# EasyEDA Pro project ProDoc_Board1_2026-04-23.epro

# Schematic Schematic1
Board Name: Board1; Create Date: 2026-03-14; Page Name: P1; Project Name: ButtonMatrix; Schematic Name: Schematic1; Update Date: 2026-03-27; Company: EasyEDA.com; Page Size: A4; Version: V1.0
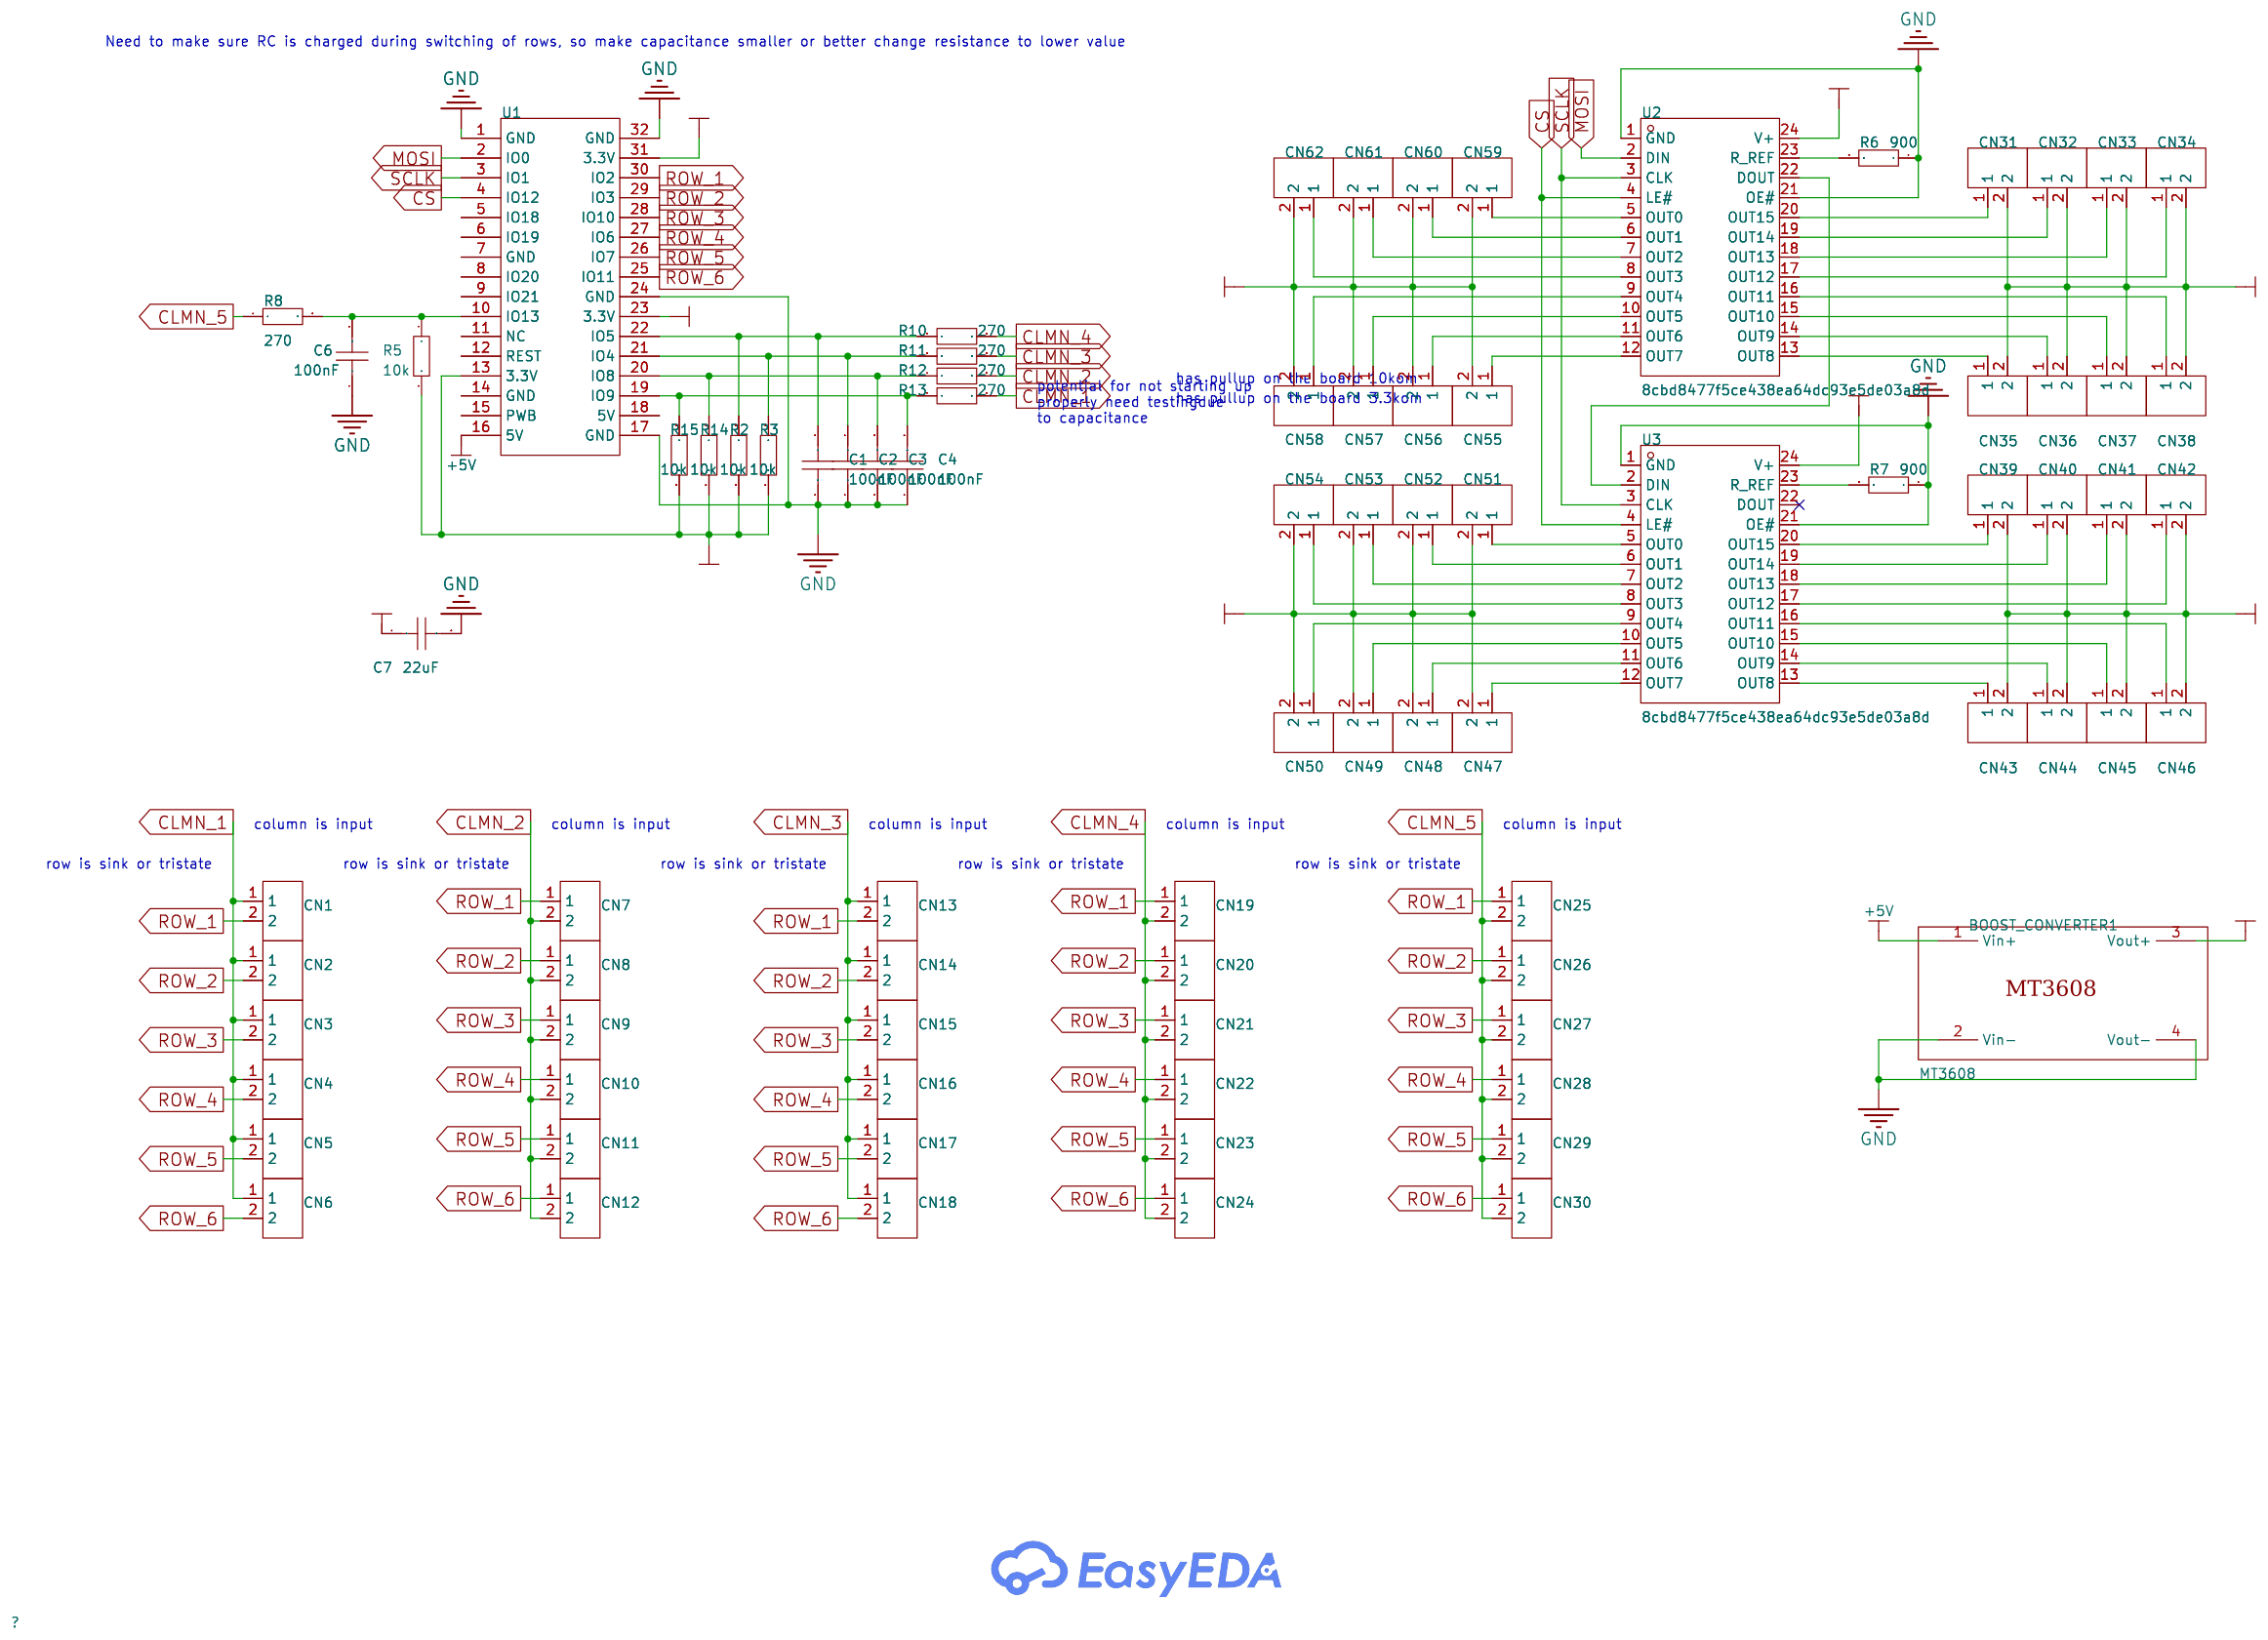
[diagram p0: schematic sheet]

## Parts
BOOST_CONVERTER1  MT3608  [MT3608 BOOST]
C1  100nF  [CAP-TH_L5.5-W2.4-P5.08-D0.6]
C2  100nF  [CAP-TH_L5.5-W2.4-P5.08-D0.6]
C3  100nF  [CAP-TH_L5.5-W2.4-P5.08-D0.6]
C4  100nF  [CAP-TH_L5.5-W2.4-P5.08-D0.6]
C6  100nF  [CAP-TH_L5.5-W2.4-P5.08-D0.6]
C7  22uF  [C1206]
CN1  HX-XH2.54-2PZZ  [CONN-TH_2P-P2.50_HX-2.54MM-2P-ZZ-MS]
CN2  HX-XH2.54-2PZZ  [CONN-TH_2P-P2.50_HX-2.54MM-2P-ZZ-MS]
CN3  HX-XH2.54-2PZZ  [CONN-TH_2P-P2.50_HX-2.54MM-2P-ZZ-MS]
CN4  HX-XH2.54-2PZZ  [CONN-TH_2P-P2.50_HX-2.54MM-2P-ZZ-MS]
CN5  HX-XH2.54-2PZZ  [CONN-TH_2P-P2.50_HX-2.54MM-2P-ZZ-MS]
CN6  HX-XH2.54-2PZZ  [CONN-TH_2P-P2.50_HX-2.54MM-2P-ZZ-MS]
CN7  HX-XH2.54-2PZZ  [CONN-TH_2P-P2.50_HX-2.54MM-2P-ZZ-MS]
CN8  HX-XH2.54-2PZZ  [CONN-TH_2P-P2.50_HX-2.54MM-2P-ZZ-MS]
CN9  HX-XH2.54-2PZZ  [CONN-TH_2P-P2.50_HX-2.54MM-2P-ZZ-MS]
CN10  HX-XH2.54-2PZZ  [CONN-TH_2P-P2.50_HX-2.54MM-2P-ZZ-MS]
CN11  HX-XH2.54-2PZZ  [CONN-TH_2P-P2.50_HX-2.54MM-2P-ZZ-MS]
CN12  HX-XH2.54-2PZZ  [CONN-TH_2P-P2.50_HX-2.54MM-2P-ZZ-MS]
CN13  HX-XH2.54-2PZZ  [CONN-TH_2P-P2.50_HX-2.54MM-2P-ZZ-MS]
CN14  HX-XH2.54-2PZZ  [CONN-TH_2P-P2.50_HX-2.54MM-2P-ZZ-MS]
CN15  HX-XH2.54-2PZZ  [CONN-TH_2P-P2.50_HX-2.54MM-2P-ZZ-MS]
CN16  HX-XH2.54-2PZZ  [CONN-TH_2P-P2.50_HX-2.54MM-2P-ZZ-MS]
CN17  HX-XH2.54-2PZZ  [CONN-TH_2P-P2.50_HX-2.54MM-2P-ZZ-MS]
CN18  HX-XH2.54-2PZZ  [CONN-TH_2P-P2.50_HX-2.54MM-2P-ZZ-MS]
CN19  HX-XH2.54-2PZZ  [CONN-TH_2P-P2.50_HX-2.54MM-2P-ZZ-MS]
CN20  HX-XH2.54-2PZZ  [CONN-TH_2P-P2.50_HX-2.54MM-2P-ZZ-MS]
CN21  HX-XH2.54-2PZZ  [CONN-TH_2P-P2.50_HX-2.54MM-2P-ZZ-MS]
CN22  HX-XH2.54-2PZZ  [CONN-TH_2P-P2.50_HX-2.54MM-2P-ZZ-MS]
CN23  HX-XH2.54-2PZZ  [CONN-TH_2P-P2.50_HX-2.54MM-2P-ZZ-MS]
CN24  HX-XH2.54-2PZZ  [CONN-TH_2P-P2.50_HX-2.54MM-2P-ZZ-MS]
CN25  HX-XH2.54-2PZZ  [CONN-TH_2P-P2.50_HX-2.54MM-2P-ZZ-MS]
CN26  HX-XH2.54-2PZZ  [CONN-TH_2P-P2.50_HX-2.54MM-2P-ZZ-MS]
CN27  HX-XH2.54-2PZZ  [CONN-TH_2P-P2.50_HX-2.54MM-2P-ZZ-MS]
CN28  HX-XH2.54-2PZZ  [CONN-TH_2P-P2.50_HX-2.54MM-2P-ZZ-MS]
CN29  HX-XH2.54-2PZZ  [CONN-TH_2P-P2.50_HX-2.54MM-2P-ZZ-MS]
CN30  HX-XH2.54-2PZZ  [CONN-TH_2P-P2.50_HX-2.54MM-2P-ZZ-MS]
CN31  HX-XH2.54-2PZZ  [CONN-TH_2P-P2.50_HX-2.54MM-2P-ZZ-MS]
CN32  HX-XH2.54-2PZZ  [CONN-TH_2P-P2.50_HX-2.54MM-2P-ZZ-MS]
CN33  HX-XH2.54-2PZZ  [CONN-TH_2P-P2.50_HX-2.54MM-2P-ZZ-MS]
CN34  HX-XH2.54-2PZZ  [CONN-TH_2P-P2.50_HX-2.54MM-2P-ZZ-MS]
CN35  HX-XH2.54-2PZZ  [CONN-TH_2P-P2.50_HX-2.54MM-2P-ZZ-MS]
CN36  HX-XH2.54-2PZZ  [CONN-TH_2P-P2.50_HX-2.54MM-2P-ZZ-MS]
CN37  HX-XH2.54-2PZZ  [CONN-TH_2P-P2.50_HX-2.54MM-2P-ZZ-MS]
CN38  HX-XH2.54-2PZZ  [CONN-TH_2P-P2.50_HX-2.54MM-2P-ZZ-MS]
CN39  HX-XH2.54-2PZZ  [CONN-TH_2P-P2.50_HX-2.54MM-2P-ZZ-MS]
CN40  HX-XH2.54-2PZZ  [CONN-TH_2P-P2.50_HX-2.54MM-2P-ZZ-MS]
CN41  HX-XH2.54-2PZZ  [CONN-TH_2P-P2.50_HX-2.54MM-2P-ZZ-MS]
CN42  HX-XH2.54-2PZZ  [CONN-TH_2P-P2.50_HX-2.54MM-2P-ZZ-MS]
CN43  HX-XH2.54-2PZZ  [CONN-TH_2P-P2.50_HX-2.54MM-2P-ZZ-MS]
CN44  HX-XH2.54-2PZZ  [CONN-TH_2P-P2.50_HX-2.54MM-2P-ZZ-MS]
CN45  HX-XH2.54-2PZZ  [CONN-TH_2P-P2.50_HX-2.54MM-2P-ZZ-MS]
CN46  HX-XH2.54-2PZZ  [CONN-TH_2P-P2.50_HX-2.54MM-2P-ZZ-MS]
CN47  HX-XH2.54-2PZZ  [CONN-TH_2P-P2.50_HX-2.54MM-2P-ZZ-MS]
CN48  HX-XH2.54-2PZZ  [CONN-TH_2P-P2.50_HX-2.54MM-2P-ZZ-MS]
CN49  HX-XH2.54-2PZZ  [CONN-TH_2P-P2.50_HX-2.54MM-2P-ZZ-MS]
CN50  HX-XH2.54-2PZZ  [CONN-TH_2P-P2.50_HX-2.54MM-2P-ZZ-MS]
CN51  HX-XH2.54-2PZZ  [CONN-TH_2P-P2.50_HX-2.54MM-2P-ZZ-MS]
CN52  HX-XH2.54-2PZZ  [CONN-TH_2P-P2.50_HX-2.54MM-2P-ZZ-MS]
CN53  HX-XH2.54-2PZZ  [CONN-TH_2P-P2.50_HX-2.54MM-2P-ZZ-MS]
CN54  HX-XH2.54-2PZZ  [CONN-TH_2P-P2.50_HX-2.54MM-2P-ZZ-MS]
CN55  HX-XH2.54-2PZZ  [CONN-TH_2P-P2.50_HX-2.54MM-2P-ZZ-MS]
CN56  HX-XH2.54-2PZZ  [CONN-TH_2P-P2.50_HX-2.54MM-2P-ZZ-MS]
CN57  HX-XH2.54-2PZZ  [CONN-TH_2P-P2.50_HX-2.54MM-2P-ZZ-MS]
CN58  HX-XH2.54-2PZZ  [CONN-TH_2P-P2.50_HX-2.54MM-2P-ZZ-MS]
CN59  HX-XH2.54-2PZZ  [CONN-TH_2P-P2.50_HX-2.54MM-2P-ZZ-MS]
CN60  HX-XH2.54-2PZZ  [CONN-TH_2P-P2.50_HX-2.54MM-2P-ZZ-MS]
CN61  HX-XH2.54-2PZZ  [CONN-TH_2P-P2.50_HX-2.54MM-2P-ZZ-MS]
CN62  HX-XH2.54-2PZZ  [CONN-TH_2P-P2.50_HX-2.54MM-2P-ZZ-MS]
R2  10k  [Resistors_ThroughHole:Resistor_Horizontal_RM7mm]
R3  10k  [Resistors_ThroughHole:Resistor_Horizontal_RM7mm]
R5  10k  [Resistors_ThroughHole:Resistor_Horizontal_RM7mm]
R6  900  [RES-TH]
R7  900  [RES-TH]
R8  270  [Resistors_ThroughHole:Resistor_Horizontal_RM7mm]
R10  270  [Resistors_ThroughHole:Resistor_Horizontal_RM7mm]
R11  270  [Resistors_ThroughHole:Resistor_Horizontal_RM7mm]
R12  270  [Resistors_ThroughHole:Resistor_Horizontal_RM7mm]
R13  270  [Resistors_ThroughHole:Resistor_Horizontal_RM7mm]
R14  10k  [Resistors_ThroughHole:Resistor_Horizontal_RM7mm]
R15  10k  [Resistors_ThroughHole:Resistor_Horizontal_RM7mm]
U1  -  [ESP32C3 LUATOS FOOT]
U2  8cbd8477f5ce438ea64dc93e5de03a8d  [CDIP-24_L32.4-W19.6-P2.54-LS15.2-BL]
U3  8cbd8477f5ce438ea64dc93e5de03a8d  [CDIP-24_L32.4-W19.6-P2.54-LS15.2-BL]

## Library data of the parts
BOOST_CONVERTER1 = MT3608
C1-C4 C6 = CC1H104ZC1ED3F5O1100: Capacitance:100nF Tolerance:-20%~+80% Tolerance:-20%~+80% Voltage Rating:50V Pin Spacing:5.08mm Temperature Coefficient:Y5V Diameter:5.5mm Body Thickness:2.4mm; LCSC Part Name: 100nF -20%~+80% 50V; Supplier Part: C2832507; Manufacturer: Dersonic(德尔创); Supplier Footprint: 插件,P=5.08mm; JLCPCB Part Class: Extended Part; Datasheet: https://item.szlcsc.com/datasheet/CC1H104ZC1ED3F5O1100/2990645.html; Supplier: LCSC; Tolerance: -20%~+80%; Voltage Rating: 50V; Pin Spacing: 5.08mm; Temperature Coefficient: Y5V; Diameter: 5.5mm; Body Thickness: 2.4mm
C7 = FCC1206X226K250HT: Capacitance:22uF Tolerance:±10% Tolerance:±10% Voltage Rating:25V Temperature Coefficient:X5R; LCSC Part Name: 22uF ±10% 25V; Supplier Part: C7419438; Manufacturer: FOJAN(富捷); Supplier Footprint: 1206; JLCPCB Part Class: Extended Part; Datasheet: https://item.szlcsc.com/datasheet/FCC1206X226K250HT/8393420.html; Supplier: LCSC; Tolerance: ±10%; Voltage Rating: 25V; Temperature Coefficient: X5R
CN1-CN62 = HX-XH2.54-2PZZ: Pins Structure:1x2P Pitch:2.54mm Mounting Type:Straight Reference Series:XH Number of Pins:2P Number of Rows:1 Number of PINs Per Row:2 Row Spacing:- Current Rating:3A Contact Material:Brass Contact Plating:Tin Operating Temperature:-25℃~+85℃ Operating Te; LCSC Part Name: 1x2P 间距:2.5mm 直插 系列:XH; Supplier Part: C42391660; Manufacturer: hanxia(韩下); Supplier Footprint: 插件,P=2.5mm; JLCPCB Part Class: Extended Part; Datasheet: https://item.szlcsc.com/datasheet/HX-XH2.54-2PZZ/44326932.html; Supplier: LCSC; Pins Structure: 1x2P; Pitch: 2.54mm; Mounting Type: Straight; Reference Series: XH; Number of Pins: 2P; Number of Rows: 1; Number of PINs Per Row: 2; Current Rating: 3A; Contact Material: Brass; Contact Plating: Tin; Operating Temperature: -25℃~+85℃; Voltage Rating: 250V; Plastic Material: PA66; Flame Retardant Rating: UL94V-0; Color: White
R2 R3 R5-R8 R10-R15 = Res_0603: Supplier Footprint: 0603
U1 = ESP32-C3-LUATOS
U2 U3 = DM135B: Type:- Input Voltage:3V~5.5V Input Voltage:3V~5.5V Channels:16 Output Voltage:5.5V Output Voltage:5.5V Output Current:55mA Topology:- Operating temperature:-40℃~+125℃ Operating temperature:-40℃~+125℃; Supplier Footprint: SOIC-24-300mil; Datasheet: https://static.chipdip.ru/lib/776/DOC059776012.pdf; Input Voltage: 3V~5V; Channels: 16; Output Voltage: 17V; Output Current: 60mA

## Nets
+3.3V: C7.1 R2.2 R3.2 R5.2 R14.2 R15.2 U1.13(3.3V) U1.23(3.3V) U1.31(3.3V) U2.24(V+) U3.24(V+)
+5V: BOOST_CONVERTER1.1(Vin+) U1.16(5V)
+12V: BOOST_CONVERTER1.3(Vout+) CN31.2 CN32.2 CN33.2 CN34.2 CN35.2 CN36.2 CN37.2 CN38.2 CN39.2 CN40.2 CN41.2 CN42.2 CN43.2 CN44.2 CN45.2 CN46.2 CN47.2 CN48.2 CN49.2 CN50.2 CN51.2 CN52.2 CN53.2 CN54.2 CN55.2 CN56.2 CN57.2 CN58.2 CN59.2 CN60.2 CN61.2 CN62.2
GND: BOOST_CONVERTER1.2(Vin-) BOOST_CONVERTER1.4(Vout-) C1.1 C2.1 C3.1 C4.1 C6.1 C7.2 R6.1 R7.1 U1.1(GND) U1.17(GND) U1.24(GND) U1.32(GND) U2.1(GND) U2.21(OE#) U3.1(GND) U3.21(OE#)
CLMN_1: CN1.1 CN2.1 CN3.1 CN4.1 CN5.1 CN6.1 R13.2
CLMN_2: CN7.2 CN8.2 CN9.2 CN10.2 CN11.2 CN12.2 R12.2
CLMN_3: CN13.1 CN14.1 CN15.1 CN16.1 CN17.1 CN18.1 R11.2
CLMN_4: CN19.2 CN20.2 CN21.2 CN22.2 CN23.2 CN24.2 R10.2
CLMN_5: CN25.2 CN26.2 CN27.2 CN28.2 CN29.2 CN30.2 R8.1
CS: U1.4(IO12) U2.4(LE#) U3.4(LE#)
MOSI: U1.2(IO0) U2.2(DIN)
ROW_1: CN1.2 CN7.1 CN13.2 CN19.1 CN25.1 U1.30(IO2)
ROW_2: CN2.2 CN8.1 CN14.2 CN20.1 CN26.1 U1.29(IO3)
ROW_3: CN3.2 CN9.1 CN15.2 CN21.1 CN27.1 U1.28(IO10)
ROW_4: CN4.2 CN10.1 CN16.2 CN22.1 CN28.1 U1.27(IO6)
ROW_5: CN5.2 CN11.1 CN17.2 CN23.1 CN29.1 U1.26(IO7)
ROW_6: CN6.2 CN12.1 CN18.2 CN24.1 CN30.1 U1.25(IO11)
SCLK: U1.3(IO1) U2.3(CLK) U3.3(CLK)
$1N1542: R6.2 U2.23(R_REF)
$1N1585: U2.22(DOUT) U3.2(DIN)
$1N1679: R7.2 U3.23(R_REF)
$1N2377: C6.2 R5.1 R8.2 U1.10(IO13)
$1N2446: C1.2 R2.1 R10.1 U1.22(IO5)
$1N2480: C2.2 R3.1 R11.1 U1.21(IO4)
$1N2512: C3.2 R12.1 R14.1 U1.20(IO8)
$1N2541: C4.2 R13.1 R15.1 U1.19(IO9)
$1N5452: CN31.1 U2.20(OUT15)
$1N5457: CN32.1 U2.19(OUT14)
$1N5463: CN33.1 U2.18(OUT13)
$1N5469: CN34.1 U2.17(OUT12)
$1N5478: CN38.1 U2.16(OUT11)
$1N5486: CN37.1 U2.15(OUT10)
$1N5492: CN36.1 U2.14(OUT9)
$1N5498: CN35.1 U2.13(OUT8)
$1N6016: CN39.1 U3.20(OUT15)
$1N6019: CN41.1 U3.18(OUT13)
$1N6035: CN46.1 U3.16(OUT11)
$1N6038: CN45.1 U3.15(OUT10)
$1N6041: CN44.1 U3.14(OUT9)
$1N6044: CN43.1 U3.13(OUT8)
$1N6046: CN40.1 U3.19(OUT14)
$1N6049: CN42.1 U3.17(OUT12)
$1N6435: CN47.1 U3.12(OUT7)
$1N6438: CN49.1 U3.10(OUT5)
$1N6454: CN54.1 U3.8(OUT3)
$1N6457: CN53.1 U3.7(OUT2)
$1N6460: CN52.1 U3.6(OUT1)
$1N6463: CN51.1 U3.5(OUT0)
$1N6465: CN48.1 U3.11(OUT6)
$1N6468: CN50.1 U3.9(OUT4)
$1N7285: CN57.1 U2.10(OUT5)
$1N7288: CN58.1 U2.9(OUT4)
$1N7291: CN61.1 U2.7(OUT2)
$1N7294: CN60.1 U2.6(OUT1)
$1N7297: CN59.1 U2.5(OUT0)
$1N7299: CN55.1 U2.12(OUT7)
$1N7302: CN62.1 U2.8(OUT3)
$1N7305: CN56.1 U2.11(OUT6)

Not connected (* = marked no-connect by the designer): U1 5(IO18) 6(IO19) 7(GND) 8(IO20) 9(IO21) 11(NC) 12(REST) 14(GND) 15(PWB) 18(5V); U3 22(DOUT)*

## Notes on the sheet
- Need to make sure RC is charged during switching of rows, so make capacitance smaller or better change resistance to lower value
- has pullup on the board 10kom
- has pullup on the board 3.3kom
- potential for not starting up
  properly need testingdue
  to capacitance
- column is input
- column is input
- column is input
- column is input
- column is input
- row is sink or tristate
- row is sink or tristate
- row is sink or tristate
- row is sink or tristate
- row is sink or tristate

# Board PCB1
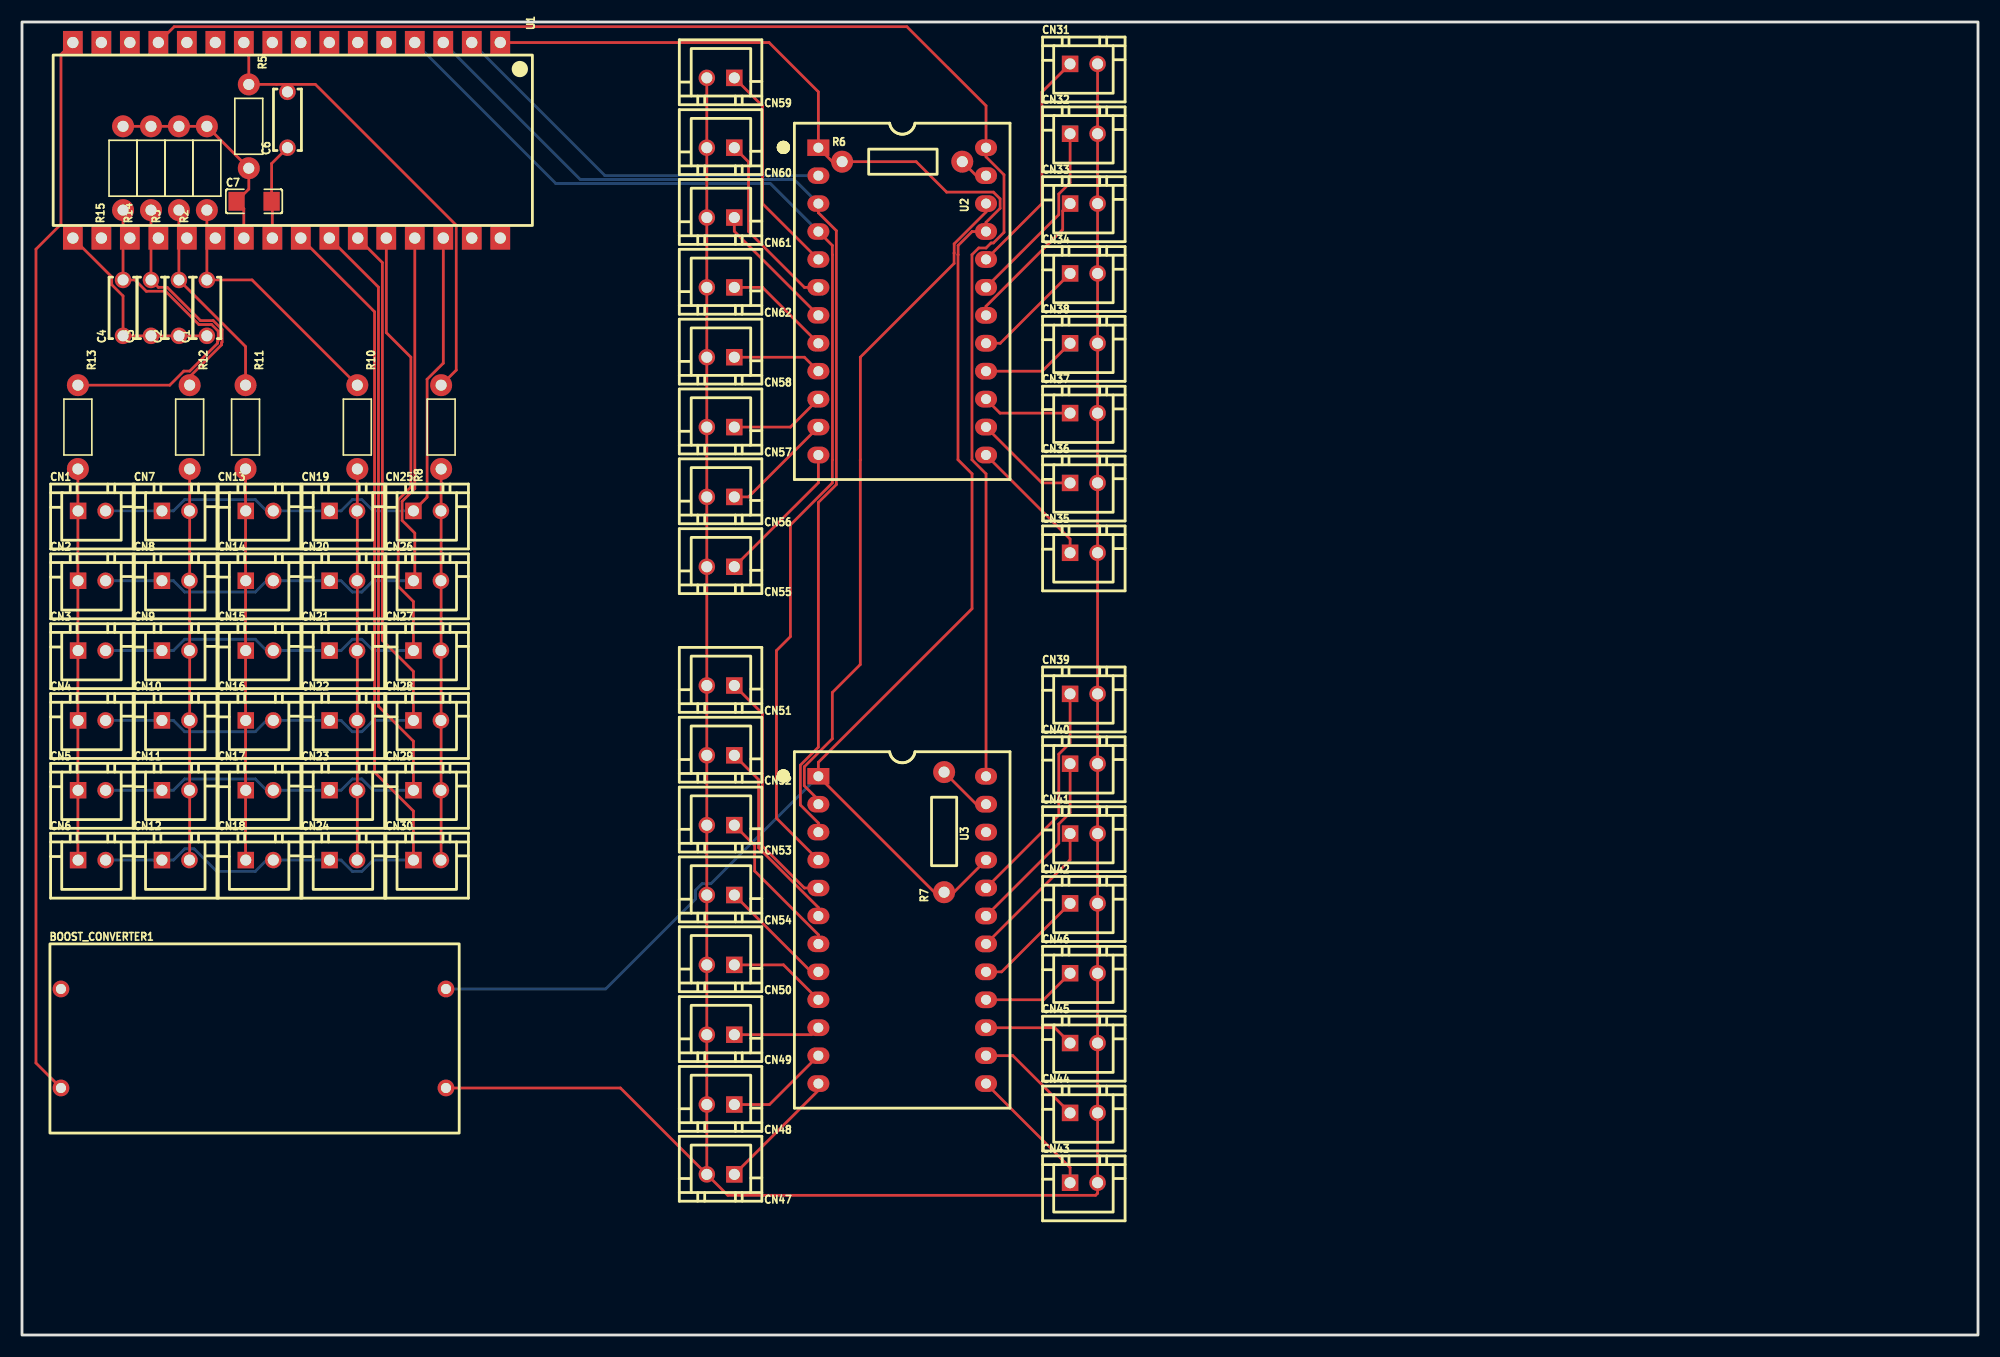
[diagram p1: board, top side]
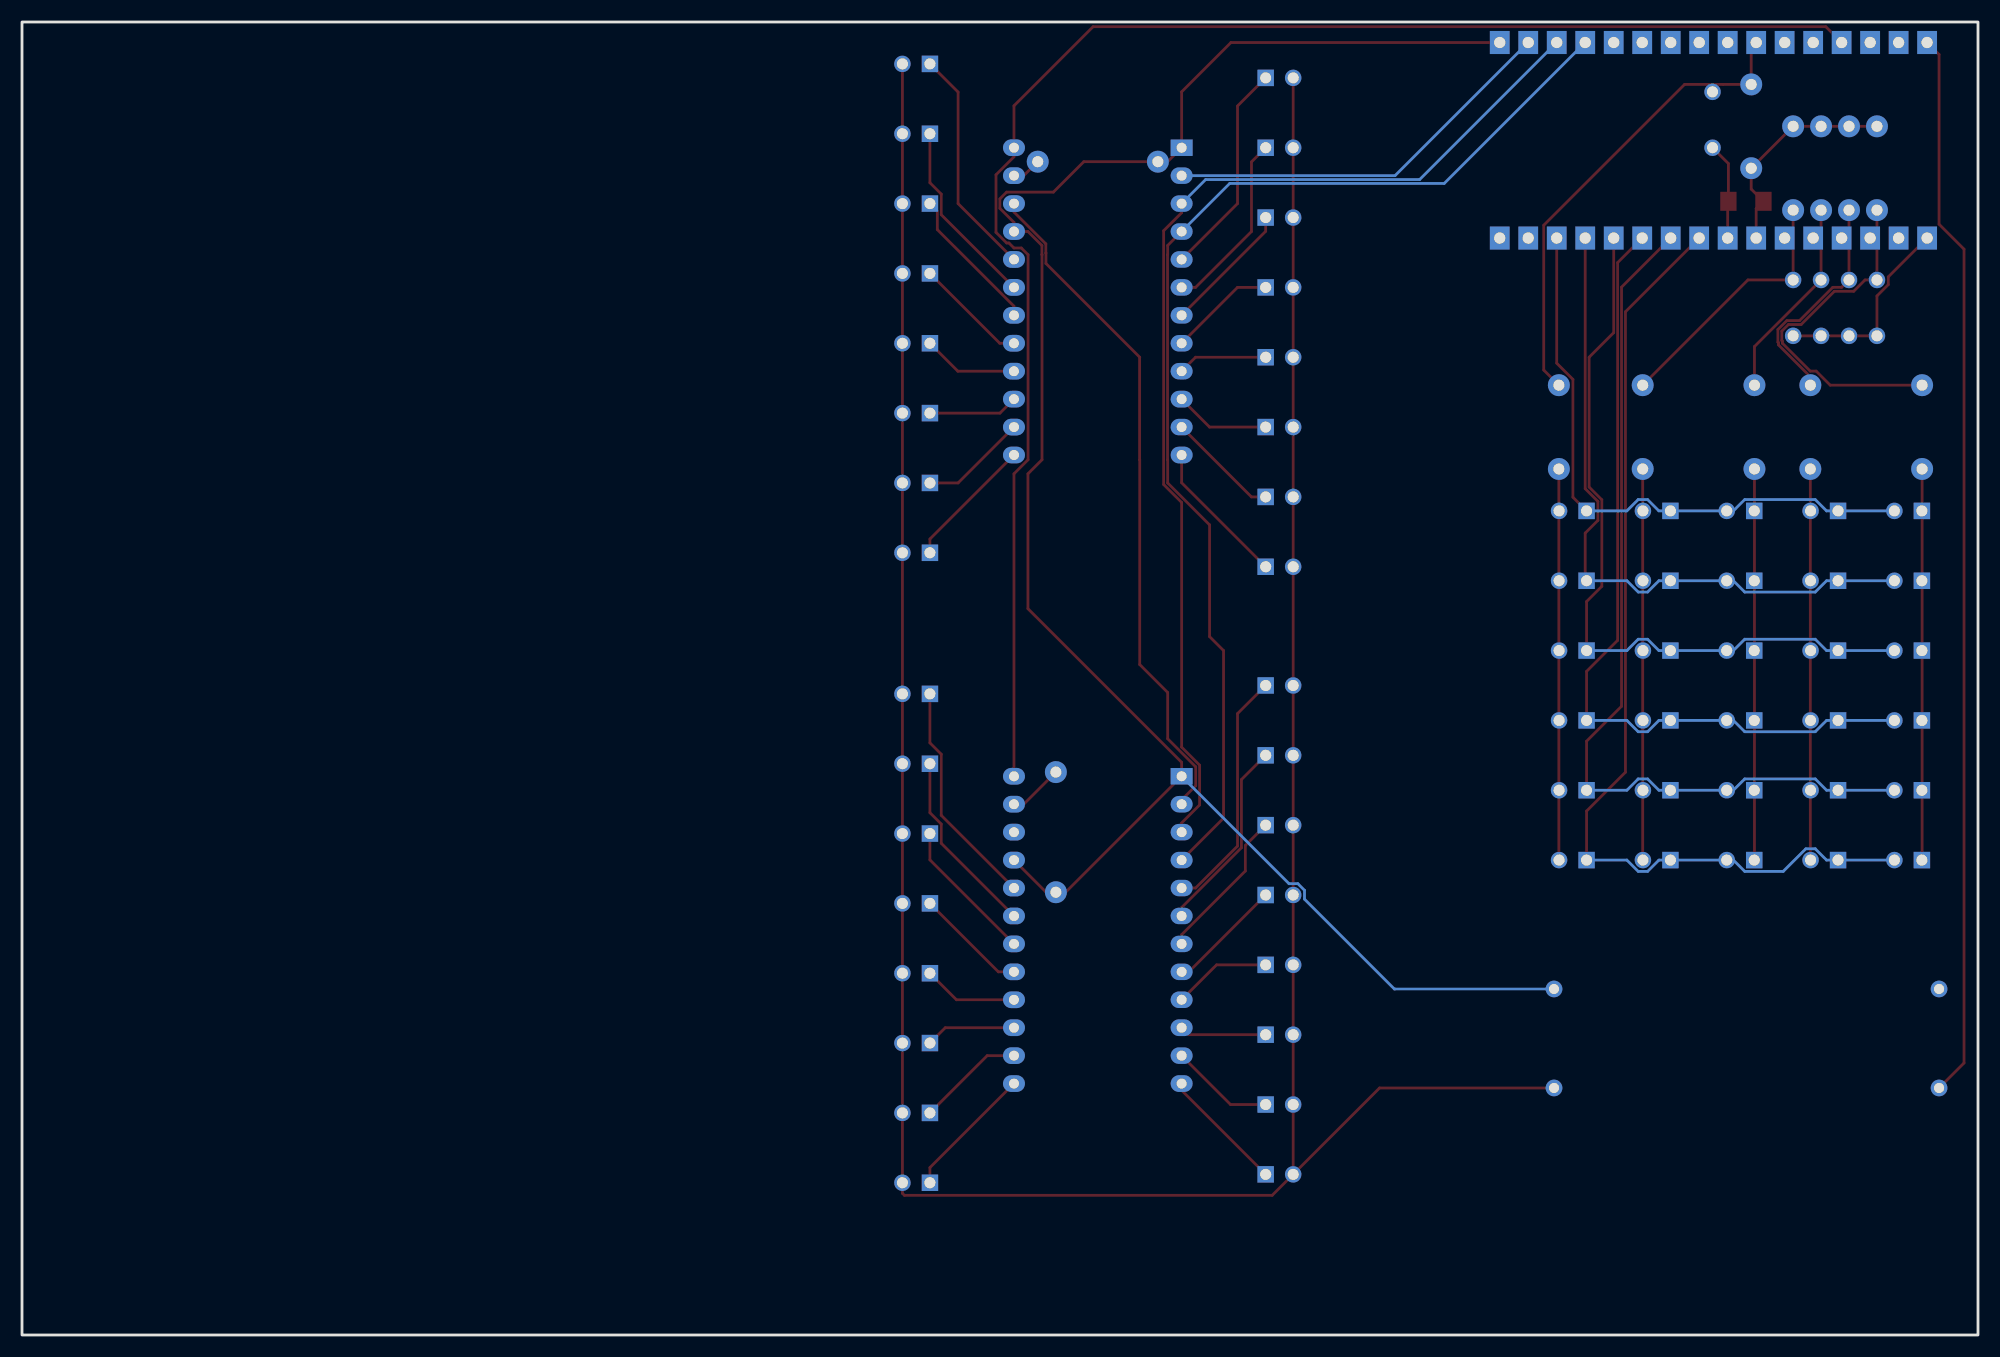
[diagram p2: board, bottom side, seen from below]

Outline 177.8 x 119.38 mm; copper layers: Top Layer, Bottom Layer. Coordinates in mm from the lower left corner of the outline.
Outline path: rectangle 0,119.38 177.8,0
Stack: Top Layer 0.035mm / Dielectric1 1.51mm FR4 er 4.5 / Bottom Layer 0.035mm

## Design rules (mm)
template: JLCPCB Capability(Two Layers Board)
spacing copperThickness1oz (default): track to track 0.102, other pairs 0.152 to 0.3
spacing copperThickness2oz: track to track 0.203, other pairs 0.152 to 0.3
track width copperThickness1oz (default): min 0.127, default 0.254, max 2.54
track width copperThickness2oz: min 0.203, default 0.254, max 2.54
differential pair differentialPair (default): width min 0.127, default 0.254, max 2.54; gap min 0.152, default 0.152
via viaSize (default): diameter min 0.5, default 0.61, max 10; hole min 0.3, default 0.305, max 6.3

## Placement (name value [footprint] x y rotation side)
BOOST_CONVERTER1  MT3608  [MT3608 BOOST]  2.54 35.56 0 top
C1  100nF  [CAP-TH_L5.5-W2.4-P5.08-D0.6]  16.8 93.39 90 top
C2  100nF  [CAP-TH_L5.5-W2.4-P5.08-D0.6]  14.26 93.39 90 top
C3  100nF  [CAP-TH_L5.5-W2.4-P5.08-D0.6]  11.72 93.39 90 top
C4  100nF  [CAP-TH_L5.5-W2.4-P5.08-D0.6]  9.18 93.39 90 top
C6  100nF  [CAP-TH_L5.5-W2.4-P5.08-D0.6]  24.13 110.49 90 top
C7  22uF  [C1206]  21.1 103.08 0 top
CN1  HX-XH2.54-2PZZ  [CONN-TH_2P-P2.50_HX-2.54MM-2P-ZZ-MS]  6.35 74.93 0 top
CN2  HX-XH2.54-2PZZ  [CONN-TH_2P-P2.50_HX-2.54MM-2P-ZZ-MS]  6.35 68.58 0 top
CN3  HX-XH2.54-2PZZ  [CONN-TH_2P-P2.50_HX-2.54MM-2P-ZZ-MS]  6.35 62.23 0 top
CN4  HX-XH2.54-2PZZ  [CONN-TH_2P-P2.50_HX-2.54MM-2P-ZZ-MS]  6.35 55.88 0 top
CN5  HX-XH2.54-2PZZ  [CONN-TH_2P-P2.50_HX-2.54MM-2P-ZZ-MS]  6.35 49.53 0 top
CN6  HX-XH2.54-2PZZ  [CONN-TH_2P-P2.50_HX-2.54MM-2P-ZZ-MS]  6.35 43.18 0 top
CN7  HX-XH2.54-2PZZ  [CONN-TH_2P-P2.50_HX-2.54MM-2P-ZZ-MS]  13.97 74.93 0 top
CN8  HX-XH2.54-2PZZ  [CONN-TH_2P-P2.50_HX-2.54MM-2P-ZZ-MS]  13.97 68.58 0 top
CN9  HX-XH2.54-2PZZ  [CONN-TH_2P-P2.50_HX-2.54MM-2P-ZZ-MS]  13.97 62.23 0 top
CN10  HX-XH2.54-2PZZ  [CONN-TH_2P-P2.50_HX-2.54MM-2P-ZZ-MS]  13.97 55.88 0 top
CN11  HX-XH2.54-2PZZ  [CONN-TH_2P-P2.50_HX-2.54MM-2P-ZZ-MS]  13.97 49.53 0 top
CN12  HX-XH2.54-2PZZ  [CONN-TH_2P-P2.50_HX-2.54MM-2P-ZZ-MS]  13.97 43.18 0 top
CN13  HX-XH2.54-2PZZ  [CONN-TH_2P-P2.50_HX-2.54MM-2P-ZZ-MS]  21.59 74.93 0 top
CN14  HX-XH2.54-2PZZ  [CONN-TH_2P-P2.50_HX-2.54MM-2P-ZZ-MS]  21.59 68.58 0 top
CN15  HX-XH2.54-2PZZ  [CONN-TH_2P-P2.50_HX-2.54MM-2P-ZZ-MS]  21.59 62.23 0 top
CN16  HX-XH2.54-2PZZ  [CONN-TH_2P-P2.50_HX-2.54MM-2P-ZZ-MS]  21.59 55.88 0 top
CN17  HX-XH2.54-2PZZ  [CONN-TH_2P-P2.50_HX-2.54MM-2P-ZZ-MS]  21.59 49.53 0 top
CN18  HX-XH2.54-2PZZ  [CONN-TH_2P-P2.50_HX-2.54MM-2P-ZZ-MS]  21.59 43.18 0 top
CN19  HX-XH2.54-2PZZ  [CONN-TH_2P-P2.50_HX-2.54MM-2P-ZZ-MS]  29.21 74.93 0 top
CN20  HX-XH2.54-2PZZ  [CONN-TH_2P-P2.50_HX-2.54MM-2P-ZZ-MS]  29.21 68.58 0 top
CN21  HX-XH2.54-2PZZ  [CONN-TH_2P-P2.50_HX-2.54MM-2P-ZZ-MS]  29.21 62.23 0 top
CN22  HX-XH2.54-2PZZ  [CONN-TH_2P-P2.50_HX-2.54MM-2P-ZZ-MS]  29.21 55.88 0 top
CN23  HX-XH2.54-2PZZ  [CONN-TH_2P-P2.50_HX-2.54MM-2P-ZZ-MS]  29.21 49.53 0 top
CN24  HX-XH2.54-2PZZ  [CONN-TH_2P-P2.50_HX-2.54MM-2P-ZZ-MS]  29.21 43.18 0 top
CN25  HX-XH2.54-2PZZ  [CONN-TH_2P-P2.50_HX-2.54MM-2P-ZZ-MS]  36.83 74.93 0 top
CN26  HX-XH2.54-2PZZ  [CONN-TH_2P-P2.50_HX-2.54MM-2P-ZZ-MS]  36.83 68.58 0 top
CN27  HX-XH2.54-2PZZ  [CONN-TH_2P-P2.50_HX-2.54MM-2P-ZZ-MS]  36.83 62.23 0 top
CN28  HX-XH2.54-2PZZ  [CONN-TH_2P-P2.50_HX-2.54MM-2P-ZZ-MS]  36.83 55.88 0 top
CN29  HX-XH2.54-2PZZ  [CONN-TH_2P-P2.50_HX-2.54MM-2P-ZZ-MS]  36.83 49.53 0 top
CN30  HX-XH2.54-2PZZ  [CONN-TH_2P-P2.50_HX-2.54MM-2P-ZZ-MS]  36.83 43.18 0 top
CN31  HX-XH2.54-2PZZ  [CONN-TH_2P-P2.50_HX-2.54MM-2P-ZZ-MS]  96.52 115.57 0 top
CN32  HX-XH2.54-2PZZ  [CONN-TH_2P-P2.50_HX-2.54MM-2P-ZZ-MS]  96.52 109.22 0 top
CN33  HX-XH2.54-2PZZ  [CONN-TH_2P-P2.50_HX-2.54MM-2P-ZZ-MS]  96.52 102.87 0 top
CN34  HX-XH2.54-2PZZ  [CONN-TH_2P-P2.50_HX-2.54MM-2P-ZZ-MS]  96.52 96.52 0 top
CN35  HX-XH2.54-2PZZ  [CONN-TH_2P-P2.50_HX-2.54MM-2P-ZZ-MS]  96.52 71.12 0 top
CN36  HX-XH2.54-2PZZ  [CONN-TH_2P-P2.50_HX-2.54MM-2P-ZZ-MS]  96.52 77.47 0 top
CN37  HX-XH2.54-2PZZ  [CONN-TH_2P-P2.50_HX-2.54MM-2P-ZZ-MS]  96.52 83.82 0 top
CN38  HX-XH2.54-2PZZ  [CONN-TH_2P-P2.50_HX-2.54MM-2P-ZZ-MS]  96.52 90.17 0 top
CN39  HX-XH2.54-2PZZ  [CONN-TH_2P-P2.50_HX-2.54MM-2P-ZZ-MS]  96.52 58.29 0 top
CN40  HX-XH2.54-2PZZ  [CONN-TH_2P-P2.50_HX-2.54MM-2P-ZZ-MS]  96.52 51.94 0 top
CN41  HX-XH2.54-2PZZ  [CONN-TH_2P-P2.50_HX-2.54MM-2P-ZZ-MS]  96.52 45.59 0 top
CN42  HX-XH2.54-2PZZ  [CONN-TH_2P-P2.50_HX-2.54MM-2P-ZZ-MS]  96.52 39.24 0 top
CN43  HX-XH2.54-2PZZ  [CONN-TH_2P-P2.50_HX-2.54MM-2P-ZZ-MS]  96.52 13.84 0 top
CN44  HX-XH2.54-2PZZ  [CONN-TH_2P-P2.50_HX-2.54MM-2P-ZZ-MS]  96.52 20.19 0 top
CN45  HX-XH2.54-2PZZ  [CONN-TH_2P-P2.50_HX-2.54MM-2P-ZZ-MS]  96.52 26.54 0 top
CN46  HX-XH2.54-2PZZ  [CONN-TH_2P-P2.50_HX-2.54MM-2P-ZZ-MS]  96.52 32.89 0 top
CN47  HX-XH2.54-2PZZ  [CONN-TH_2P-P2.50_HX-2.54MM-2P-ZZ-MS]  63.5 14.6 180 top
CN48  HX-XH2.54-2PZZ  [CONN-TH_2P-P2.50_HX-2.54MM-2P-ZZ-MS]  63.5 20.95 180 top
CN49  HX-XH2.54-2PZZ  [CONN-TH_2P-P2.50_HX-2.54MM-2P-ZZ-MS]  63.5 27.31 180 top
CN50  HX-XH2.54-2PZZ  [CONN-TH_2P-P2.50_HX-2.54MM-2P-ZZ-MS]  63.5 33.66 180 top
CN51  HX-XH2.54-2PZZ  [CONN-TH_2P-P2.50_HX-2.54MM-2P-ZZ-MS]  63.5 59.05 180 top
CN52  HX-XH2.54-2PZZ  [CONN-TH_2P-P2.50_HX-2.54MM-2P-ZZ-MS]  63.5 52.7 180 top
CN53  HX-XH2.54-2PZZ  [CONN-TH_2P-P2.50_HX-2.54MM-2P-ZZ-MS]  63.5 46.35 180 top
CN54  HX-XH2.54-2PZZ  [CONN-TH_2P-P2.50_HX-2.54MM-2P-ZZ-MS]  63.5 40 180 top
CN55  HX-XH2.54-2PZZ  [CONN-TH_2P-P2.50_HX-2.54MM-2P-ZZ-MS]  63.5 69.85 180 top
CN56  HX-XH2.54-2PZZ  [CONN-TH_2P-P2.50_HX-2.54MM-2P-ZZ-MS]  63.5 76.2 180 top
CN57  HX-XH2.54-2PZZ  [CONN-TH_2P-P2.50_HX-2.54MM-2P-ZZ-MS]  63.5 82.55 180 top
CN58  HX-XH2.54-2PZZ  [CONN-TH_2P-P2.50_HX-2.54MM-2P-ZZ-MS]  63.5 88.9 180 top
CN59  HX-XH2.54-2PZZ  [CONN-TH_2P-P2.50_HX-2.54MM-2P-ZZ-MS]  63.5 114.3 180 top
CN60  HX-XH2.54-2PZZ  [CONN-TH_2P-P2.50_HX-2.54MM-2P-ZZ-MS]  63.5 107.95 180 top
CN61  HX-XH2.54-2PZZ  [CONN-TH_2P-P2.50_HX-2.54MM-2P-ZZ-MS]  63.5 101.6 180 top
CN62  HX-XH2.54-2PZZ  [CONN-TH_2P-P2.50_HX-2.54MM-2P-ZZ-MS]  63.5 95.25 180 top
R2  10k  [Resistors_ThroughHole:Resistor_Horizontal_RM7mm]  16.8 102.28 90 top
R3  10k  [Resistors_ThroughHole:Resistor_Horizontal_RM7mm]  14.26 102.28 90 top
R5  10k  [Resistors_ThroughHole:Resistor_Horizontal_RM7mm]  20.61 113.71 270 top
R6  900  [RES-TH]  80.01 106.68 0 top
R7  900  [RES-TH]  83.82 45.72 90 top
R8  270  [Resistors_ThroughHole:Resistor_Horizontal_RM7mm]  38.1 78.74 90 top
R10  270  [Resistors_ThroughHole:Resistor_Horizontal_RM7mm]  30.48 86.36 270 top
R11  270  [Resistors_ThroughHole:Resistor_Horizontal_RM7mm]  20.32 86.36 270 top
R12  270  [Resistors_ThroughHole:Resistor_Horizontal_RM7mm]  15.24 86.36 270 top
R13  270  [Resistors_ThroughHole:Resistor_Horizontal_RM7mm]  5.08 86.36 270 top
R14  10k  [Resistors_ThroughHole:Resistor_Horizontal_RM7mm]  11.72 102.28 90 top
R15  10k  [Resistors_ThroughHole:Resistor_Horizontal_RM7mm]  9.18 102.28 90 top
U1  -  [ESP32C3 LUATOS FOOT]  43.47 117.52 270 top
U2  8cbd8477f5ce438ea64dc93e5de03a8d  [CDIP-24_L32.4-W19.6-P2.54-LS15.2-BL]  80.01 93.98 270 top
U3  8cbd8477f5ce438ea64dc93e5de03a8d  [CDIP-24_L32.4-W19.6-P2.54-LS15.2-BL]  80.01 36.83 270 top

## Footprints (pads in the part's own frame, mm; a bottom-side part is the same pattern mirrored in y, then rotated)
C1206
  rect 1.485x1.728 smd: 1(-1.593,0) 2(1.593,0)
CAP-TH_L5.5-W2.4-P5.08-D0.6
  round 1.5 hole 1: 1(-2.54,0) 2(2.54,0)
CDIP-24_L32.4-W19.6-P2.54-LS15.2-BL
  rect 1.5x2 hole 0.9: 1(-13.97,-7.62)
  oval 1.5x2 hole 0.9: 2(-11.43,-7.62) 3(-8.89,-7.62) 4(-6.35,-7.62) 5(-3.81,-7.62) 6(-1.27,-7.62) 7(1.27,-7.62) 8(3.81,-7.62) 9(6.35,-7.62) 11(11.43,-7.62)
  oval 1.524x2 hole 0.9: 10(8.89,-7.62) 12(13.97,-7.62) 13(13.97,7.62) 14(11.43,7.62) 15(8.89,7.62) 16(6.35,7.62) 17(3.81,7.62) 18(1.27,7.62) 19(-1.27,7.62) 20(-3.81,7.62) 21(-6.35,7.62) 22(-8.89,7.62) 23(-11.43,7.62) 24(-13.97,7.62)
CONN-TH_2P-P2.50_HX-2.54MM-2P-ZZ-MS
  rect 1.5x1.5 hole 1: 1(-1.25,0)
  round 1.5 hole 1: 2(1.25,0)
ESP32C3 LUATOS FOOT
  rect 2.1x1.8 hole 1.02: 1(0,0) 2(0,-2.59) 3(0,-5.18) 4(0,-7.77) 5(0,-10.36) 6(0,-12.95) 7(0,-15.54) 8(0,-18.13) 9(0,-20.72) 10(0,-23.31) 11(0,-25.9) 12(0,-28.49) 13(0,-31.08) 14(0,-33.67) 15(0,-36.26) 16(0,-38.85) 17(17.78,-38.85) 18(17.78,-36.26) 19(17.78,-33.67) 20(17.78,-31.08) 21(17.78,-28.49) 22(17.78,-25.9) 23(17.78,-23.31) 24(17.78,-20.72) 25(17.78,-18.13) 26(17.78,-15.54) 27(17.78,-12.95) 28(17.78,-10.36) 29(17.78,-7.77) 30(17.78,-5.18) 31(17.78,-2.59) 32(17.78,0)
MT3608 BOOST
  round 1.524 hole 0.914: 1(1,-13.1) 2(1,-4.1) 3(36,-13.1) 4(36,-4.1)
RES-TH
  round 2 hole 1: 1(-5.461,0) 2(5.461,0)
Resistors_ThroughHole:Resistor_Horizontal_RM7mm
  round 1.999 hole 1.001: 1(0,0) 2(7.62,0)

## Nets
As in the schematic.

Pads without a net: U1 5 6 7 8 9 11 12 14 15 18; U3 22

## Routing (per net, layer and track width the routed paths; a pad name or vN(x,y) marks a point on that pad's centre or on a via; arc(x,y) is an arc through that point)
+3.3V: length 162.8
  Top Layer w0.254: U3.24 87.63,78.3 86.35,79.58 86.35,98.22 86.96,98.83 87.63,98.83 88.09,99.29 88.3,99.29 89.26,100.25 89.26,105.48 87.63,107.12 U2.24 87.63,111.76 80.44,118.95 13.83,118.95 U1.13 ; R15.2 R14.2 R3.2 R2.2 R5.2 20.61,104.19 C7.1 20.16,102.41 U1.23
+5V: length 97.4
  Top Layer w0.254: U1.16 3.54,116.43 3.54,101 1.27,98.73 1.27,24.73 BOOST_CONVERTER1.1
+12V: length 265.7
  Top Layer w0.254: BOOST_CONVERTER1.3 54.39,22.46 CN47.2 ; CN47.2 64.16,12.7 97.59,12.7 97.77,12.88 CN43.2 CN44.2 CN45.2 CN46.2 CN42.2 CN41.2 CN40.2 CN39.2 CN35.2 CN36.2 CN37.2 CN38.2 CN34.2 CN33.2 CN32.2 CN31.2 ; CN47.2 CN48.2 CN49.2 CN50.2 CN54.2 CN53.2 CN52.2 CN51.2 CN55.2 CN56.2 CN57.2 CN58.2 CN62.2 CN61.2 CN60.2 CN59.2
GND: length 205.8
  Top Layer w0.254: C1.1 C2.1 C3.1 C4.1 9.18,94.47 8.16,95.5 8.16,96.2 U1.17 ; U1.1 67.9,117.52 72.39,113.03 U2.1 73.66,106.68 R6.1 81.28,106.68 84.05,103.91 88.3,103.91 88.91,103.3 88.91,102.44 87.63,101.16 U2.21 86.36,100.33 85.09,99.06 85.09,98.23 85.08,98.22 85.08,79.58 86.36,78.3 86.36,66.04 72.39,52.07 U3.1 82.93,40.26 R7.1 84.71,40.26 U3.21 ; U1.24 22.75,103.01 C7.2 22.69,106.51 C6.1
  Bottom Layer w0.254: U3.1 62.62,41.03 61.82,41.03 61.22,40.43 61.22,39.63 53.05,31.46 BOOST_CONVERTER1.4
CLMN_1: length 35.6
  Top Layer w0.254: R13.2 5.08,43.2 CN6.1
CLMN_2: length 35.6
  Top Layer w0.254: R12.2 15.24,43.2 CN12.2
CLMN_3: length 35.6
  Top Layer w0.254: R11.2 20.32,43.2 CN18.1
CLMN_4: length 35.6
  Top Layer w0.254: R10.2 30.48,43.2 CN24.2
CLMN_5: length 35.6
  Top Layer w0.254: CN30.2 38.1,43.2 R8.1
CS: length 105.2
  Top Layer w0.254: U2.4 73.66,99.06 73.66,98.22 73.67,98.22 73.67,79.58 73.66,79.57 73.66,77.47 69.85,73.66 69.85,63.5 68.58,62.23 68.58,46.99 U3.4
  Bottom Layer w0.254: U1.4 48.52,104.7 68.02,104.7 U2.4
MOSI: length 36.5
  Bottom Layer w0.254: U2.2 52.99,105.41 U1.2
ROW_1: length 55.6
  Top Layer w0.254: CN25.1 36.82,76.17 36.82,86.89 38.29,88.36 U1.30
  Bottom Layer w0.254: CN1.2 CN7.1 13.77,74.93 14.79,75.96 21.21,75.96 22.23,74.93 CN13.2 CN19.1 29,74.93 30.03,75.96 30.89,75.96 31.92,74.93 CN25.1
ROW_2: length 61.8
  Top Layer w0.254: U1.29 35.7,76.95 34.55,75.8 34.55,74.06 35.7,72.91 35.7,68.7 CN26.1
  Bottom Layer w0.254: CN2.2 CN8.1 13.77,68.58 14.79,67.55 21.21,67.55 22.23,68.58 CN14.2 CN20.1 29,68.58 30.03,67.55 30.89,67.55 31.92,68.58 CN26.1
ROW_3: length 69.2
  Top Layer w0.254: CN27.1 35.58,66.69 34.19,68.07 34.19,75.94 35.35,77.1 35.35,88.9 33.11,91.13 U1.28
  Bottom Layer w0.254: CN27.1 31.92,62.23 30.89,63.26 30.03,63.26 29,62.23 CN21.1 CN15.2 22.23,62.23 21.21,63.26 14.79,63.26 13.77,62.23 CN9.1 CN3.2
ROW_4: length 75.6
  Top Layer w0.254: U1.27 32.76,97.5 32.76,63.16 35.58,60.34 CN28.1
  Bottom Layer w0.254: CN4.2 CN10.1 13.77,55.88 14.79,54.85 21.21,54.85 22.23,55.88 CN16.2 CN22.1 29,55.88 30.03,54.85 30.89,54.85 31.92,55.88 CN28.1
ROW_5: length 83.1
  Top Layer w0.254: CN29.1 35.58,53.99 32.4,57.16 32.4,95.27 U1.26
  Bottom Layer w0.254: CN5.2 CN11.1 13.77,49.53 14.79,50.56 21.21,50.56 22.23,49.53 CN23.1 29,49.53 30.03,50.56 30.89,50.56 31.92,49.53 CN29.1
ROW_6: length 91.3
  Top Layer w0.254: CN30.1 35.58,47.64 32.05,51.17 32.05,93.03 U1.25
  Bottom Layer w0.254: CN30.1 31.92,43.18 30.89,42.15 30.03,42.15 29,43.18 CN24.1 CN18.2 22.23,43.18 21.21,42.15 17.7,42.15 15.65,44.21 14.79,44.21 13.77,43.18 CN12.1 CN6.2
SCLK: length 100
  Top Layer w0.254: U3.3 72.39,46.55 70.75,48.19 70.75,51.81 72.39,53.45 72.39,75.7 74.03,77.33 74.03,100.4 72.39,102.03 U2.3
  Bottom Layer w0.254: U1.3 50.76,105.05 70.21,105.05 U2.3
$1N1542: length 2.7
  Top Layer w0.254: U2.23 86.74,105.41 R6.2
$1N1585: length 62
  Top Layer w0.254: U2.22 87.63,102.1 84.73,99.21 84.73,98.38 84.72,98.37 84.72,97.42 76.2,88.9 76.21,88.89 76.21,79.58 76.2,79.57 76.2,60.96 73.66,58.42 73.66,54.21 71.11,51.67 71.11,49.93 72.39,48.66 U3.2
$1N1679: length 5
  Top Layer w0.254: U3.23 86.74,48.26 R7.2
$1N2377: length 43.3
  Top Layer w0.254: R8.2 39.47,87.73 39.47,100.9 26.67,113.71 R5.1 20.61,117.07 U1.10
$1N2446: length 24
  Top Layer w0.254: R10.1 20.91,95.93 C1.2 R2.1
$1N2480: length 18.4
  Top Layer w0.254: R3.1 C2.2 20.32,89.87 R11.1
$1N2512: length 21
  Top Layer w0.254: R14.1 C3.2 12.4,95.25 13.2,95.25 16.22,92.23 17.38,92.23 18.19,91.42 18.19,90.27 18.14,90.22 18.14,90.02 15.24,87.13 R12.1
$1N2541: length 32.3
  Top Layer w0.254: R15.1 C4.2 10.27,95.93 11.3,94.9 13.05,94.9 16.08,91.87 17.23,91.87 17.83,91.27 17.83,90.42 17.78,90.37 17.78,90.17 15.25,87.64 14.71,87.64 13.43,86.36 R13.1
$1N5452: length 20.9
  Top Layer w0.254: U2.20 92.71,102.87 92.71,113.01 CN31.1
$1N5457: length 17.1
  Top Layer w0.254: U2.19 94.24,101.86 94.24,103.74 95.27,104.76 CN32.1
$1N5463: length 13.3
  Top Layer w0.254: U2.18 87.63,93.54 94.6,100.51 94.6,102.2 CN33.1
$1N5469: length 10.3
  Top Layer w0.254: CN34.1 88.92,90.17 U2.17
$1N5478: length 8.7
  Top Layer w0.254: CN38.1 92.73,87.63 U2.16
$1N5486: length 8.2
  Top Layer w0.254: U2.15 88.9,83.82 CN37.1
$1N5492: length 9.7
  Top Layer w0.254: U2.14 92.71,77.47 CN36.1
$1N5498: length 12.1
  Top Layer w0.254: U2.13 95.27,72.37 CN35.1
$1N6016: length 20.8
  Top Layer w0.254: CN39.1 95.27,53.84 94.24,52.81 94.24,47.25 U3.20
$1N6019: length 13.2
  Top Layer w0.254: U3.18 95.27,43.2 CN41.1
$1N6035: length 8.6
  Top Layer w0.254: U3.16 92.86,30.48 CN46.1
$1N6038: length 8.2
  Top Layer w0.254: CN45.1 93.87,27.94 U3.15
$1N6041: length 9.8
  Top Layer w0.254: U3.14 90.06,25.4 CN44.1
$1N6044: length 12.2
  Top Layer w0.254: U3.13 95.27,15.22 CN43.1
$1N6046: length 17
  Top Layer w0.254: CN40.1 95.27,47.49 94.24,46.46 94.24,44.71 U3.19
$1N6049: length 10.2
  Top Layer w0.254: U3.17 89.05,33.02 CN42.1
$1N6435: length 11.4
  Top Layer w0.254: U3.12 72.39,22.25 CN47.1
$1N6438: length 7.9
  Top Layer w0.254: CN49.1 71.75,27.31 U3.10
$1N6454: length 10.5
  Top Layer w0.254: U3.8 71.74,33.02 CN54.1
$1N6457: length 14
  Top Layer w0.254: CN53.1 66.6,44.51 66.6,42.19 72.39,36.39 U3.7
$1N6460: length 17.8
  Top Layer w0.254: CN52.1 66.95,50.5 66.95,44.3 72.39,38.87 U3.6
$1N6463: length 22.3
  Top Layer w0.254: U3.5 71.12,40.64 67.31,44.45 67.31,56.49 CN51.1
$1N6465: length 9.5
  Top Layer w0.254: CN48.1 67.94,20.95 U3.11
$1N6468: length 9
  Top Layer w0.254: CN50.1 69.22,33.66 U3.9
$1N7285: length 8.7
  Top Layer w0.254: U2.10 69.85,82.55 CN57.1
$1N7288: length 8.2
  Top Layer w0.254: CN58.1 71.12,88.9 U2.9
$1N7291: length 12.1
  Top Layer w0.254: U2.7 64.75,100.35 CN61.1
$1N7294: length 16.6
  Top Layer w0.254: U2.6 71.12,95.25 66.04,100.33 66.04,106.66 CN60.1
$1N7297: length 19.7
  Top Layer w0.254: CN59.1 67.31,111.74 67.31,102.87 U2.5
$1N7299: length 13.3
  Top Layer w0.254: U2.12 72.39,77.49 CN55.1
$1N7302: length 9.7
  Top Layer w0.254: U2.8 67.31,95.25 CN62.1
$1N7305: length 10.3
  Top Layer w0.254: CN56.1 66.04,76.2 U2.11
